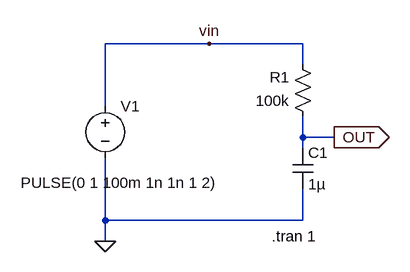
[diagram p0: schematic rc_circuit.asc]
rc_circuit.asc, the LTspice schematic file:
Version 4
SHEET 1 880 680
WIRE 224 128 64 128
WIRE 368 128 224 128
WIRE 368 160 368 128
WIRE 64 224 64 128
WIRE 368 272 368 240
WIRE 416 272 368 272
WIRE 368 288 368 272
WIRE 64 400 64 304
WIRE 368 400 368 352
WIRE 368 400 64 400
WIRE 64 432 64 400
FLAG 64 432 0
FLAG 224 128 vin
FLAG 416 272 OUT
IOPIN 416 272 Out
SYMBOL voltage 64 208 R0
WINDOW 3 -130 134 Left 2
SYMATTR Value PULSE(0 1 100m 1n 1n 1 2)
SYMATTR InstName V1
SYMBOL res 384 256 R180
WINDOW 0 36 76 Left 2
WINDOW 3 36 40 Left 2
SYMATTR InstName R1
SYMATTR Value 100k
SYMBOL cap 352 288 R0
SYMATTR InstName C1
SYMATTR Value 1µ
TEXT 320 424 Left 2 !.tran 1

The netlist it stands for:
* rc_circuit.asc
V1 vin 0 PULSE(0 1 100m 1n 1n 1 2)
R1 OUT vin 100k
C1 OUT 0 1µ
.tran 1
.backanno
.end